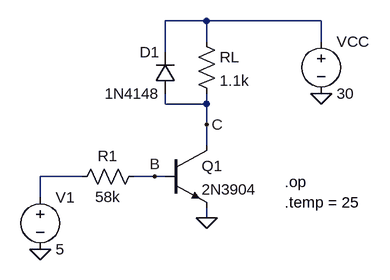
[diagram p0: schematic 008 TJB.asc]
008 TJB.asc, the LTspice schematic file:
Version 4
SHEET 1 880 680
WIRE 160 -80 96 -80
WIRE 336 -80 160 -80
WIRE 160 -48 160 -80
WIRE 336 -48 336 -80
WIRE 96 -32 96 -80
WIRE 96 48 96 32
WIRE 160 48 160 32
WIRE 160 48 96 48
WIRE 160 80 160 48
WIRE 160 112 160 80
WIRE -32 160 -96 160
WIRE 80 160 48 160
WIRE 96 160 80 160
WIRE -96 192 -96 160
WIRE 160 224 160 208
FLAG 336 32 0
FLAG 160 80 C
FLAG 80 160 B
FLAG 160 224 0
FLAG -96 272 0
SYMBOL npn 96 112 R0
SYMATTR InstName Q1
SYMATTR Value 2N3904
SYMBOL voltage 336 -64 R0
SYMATTR InstName VCC
SYMATTR Value 30
SYMBOL res 144 -64 R0
SYMATTR InstName RL
SYMATTR Value 1.1k
SYMBOL res 64 144 R90
WINDOW 0 0 56 VBottom 2
WINDOW 3 32 56 VTop 2
SYMATTR InstName R1
SYMATTR Value 58k
SYMBOL voltage -96 176 R0
SYMATTR InstName V1
SYMATTR Value 5
SYMBOL diode 112 32 R180
WINDOW 0 24 64 Left 2
WINDOW 3 24 0 Left 2
SYMATTR InstName D1
SYMATTR Value 1N4148
TEXT 280 168 Left 2 !.op
TEXT 280 200 Left 2 !.temp = 25

The netlist it stands for:
* 008 TJB.asc
Q1 C B 0 0 2N3904
VCC N001 0 30
RL N001 C 1.1k
R1 B N002 58k
V1 N002 0 5
D1 C N001 1N4148
.model D D
.lib standard.dio
.model NPN NPN
.model PNP PNP
.lib standard.bjt
.op
.temp = 25
.backanno
.end